# Altium schematic sheet BinaryInput.SchDoc
size A
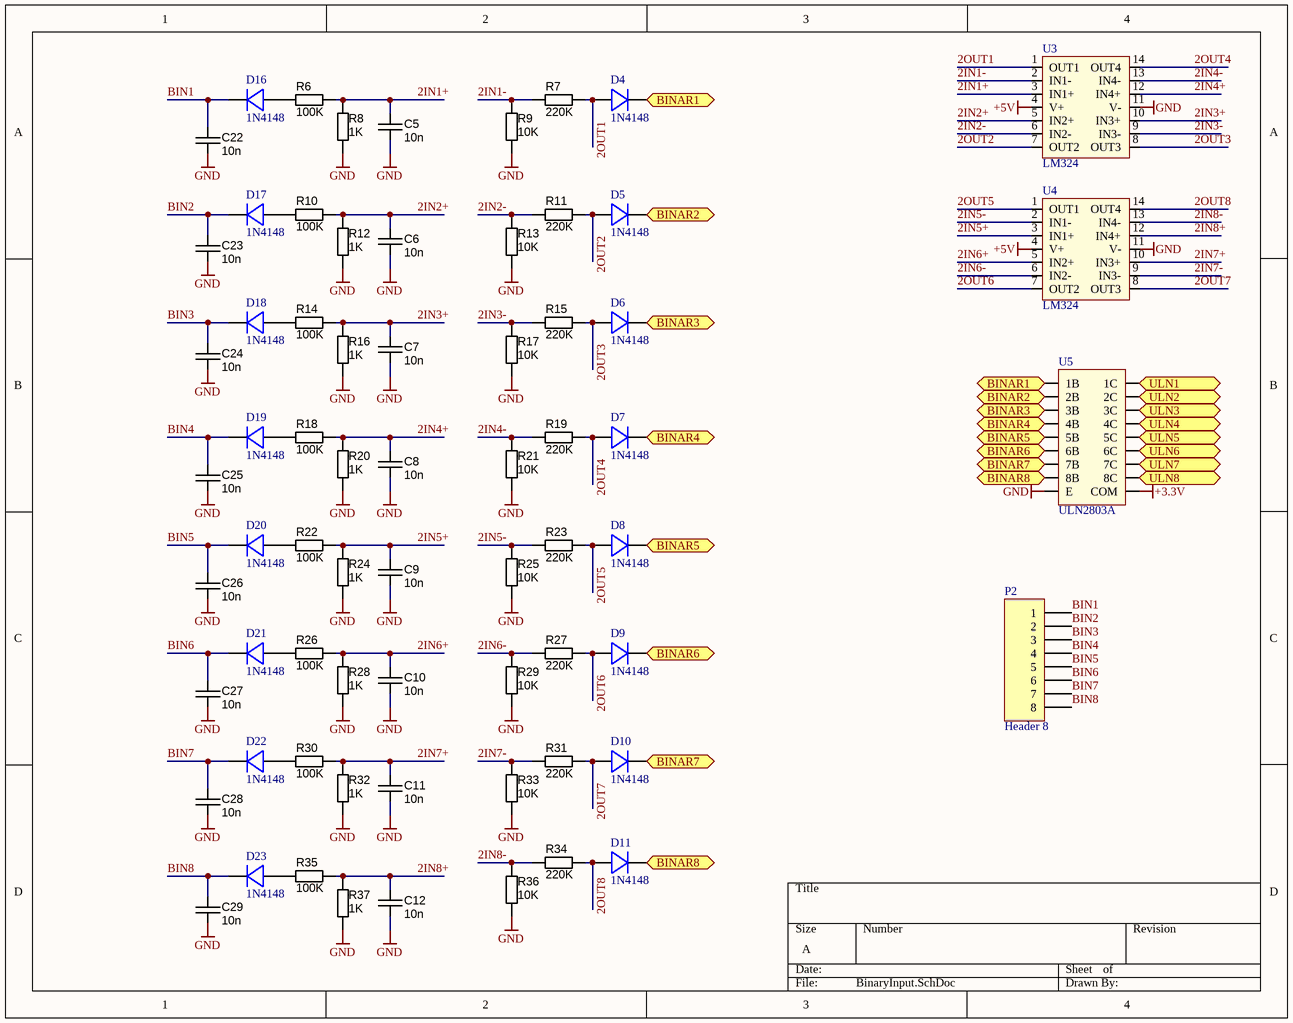
[diagram p0: BinaryInput.SchDoc]

## Parts
C5  value 10n  [CAPC2012X135N]  (hidden comment: approved sub OK)
C6  value 10n  [CAPC2012X135N]  (hidden comment: approved sub OK)
C7  value 10n  [CAPC2012X135N]  (hidden comment: approved sub OK)
C8  value 10n  [CAPC2012X135N]  (hidden comment: approved sub OK)
C9  value 10n  [CAPC2012X135N]  (hidden comment: approved sub OK)
C10  value 10n  [CAPC2012X135N]  (hidden comment: approved sub OK)
C11  value 10n  [CAPC2012X135N]  (hidden comment: approved sub OK)
C12  value 10n  [CAPC2012X135N]  (hidden comment: approved sub OK)
C22  value 10n  [CAPC2012X135N]  (hidden comment: approved sub OK)
C23  value 10n  [CAPC2012X135N]  (hidden comment: approved sub OK)
C24  value 10n  [CAPC2012X135N]  (hidden comment: approved sub OK)
C25  value 10n  [CAPC2012X135N]  (hidden comment: approved sub OK)
C26  value 10n  [CAPC2012X135N]  (hidden comment: approved sub OK)
C27  value 10n  [CAPC2012X135N]  (hidden comment: approved sub OK)
C28  value 10n  [CAPC2012X135N]  (hidden comment: approved sub OK)
C29  value 10n  [CAPC2012X135N]  (hidden comment: approved sub OK)
D4  1N4148  [SOD-323]
D5  1N4148  [SOD-323]
D6  1N4148  [SOD-323]
D7  1N4148  [SOD-323]
D8  1N4148  [SOD-323]
D9  1N4148  [SOD-323]
D10  1N4148  [SOD-323]
D11  1N4148  [SOD-323]
D16  1N4148  [SOD-323]
D17  1N4148  [SOD-323]
D18  1N4148  [SOD-323]
D19  1N4148  [SOD-323]
D20  1N4148  [SOD-323]
D21  1N4148  [SOD-323]
D22  1N4148  [SOD-323]
D23  1N4148  [SOD-323]
P2  Header 8  [HDR1X8]
R6  value 100K  [RESC2012X70N]  (hidden comment: Thick Film)
R7  value 220K  [RESC2012X70N]  (hidden comment: Thick Film)
R8  value 1K  [RESC2012X70N]  (hidden comment: Thick Film)
R9  value 10K  [RESC2012X70N]  (hidden comment: Thick Film)
R10  value 100K  [RESC2012X70N]  (hidden comment: Thick Film)
R11  value 220K  [RESC2012X70N]  (hidden comment: Thick Film)
R12  value 1K  [RESC2012X70N]  (hidden comment: Thick Film)
R13  value 10K  [RESC2012X70N]  (hidden comment: Thick Film)
R14  value 100K  [RESC2012X70N]  (hidden comment: Thick Film)
R15  value 220K  [RESC2012X70N]  (hidden comment: Thick Film)
R16  value 1K  [RESC2012X70N]  (hidden comment: Thick Film)
R17  value 10K  [RESC2012X70N]  (hidden comment: Thick Film)
R18  value 100K  [RESC2012X70N]  (hidden comment: Thick Film)
R19  value 220K  [RESC2012X70N]  (hidden comment: Thick Film)
R20  value 1K  [RESC2012X70N]  (hidden comment: Thick Film)
R21  value 10K  [RESC2012X70N]  (hidden comment: Thick Film)
R22  value 100K  [RESC2012X70N]  (hidden comment: Thick Film)
R23  value 220K  [RESC2012X70N]  (hidden comment: Thick Film)
R24  value 1K  [RESC2012X70N]  (hidden comment: Thick Film)
R25  value 10K  [RESC2012X70N]  (hidden comment: Thick Film)
R26  value 100K  [RESC2012X70N]  (hidden comment: Thick Film)
R27  value 220K  [RESC2012X70N]  (hidden comment: Thick Film)
R28  value 1K  [RESC2012X70N]  (hidden comment: Thick Film)
R29  value 10K  [RESC2012X70N]  (hidden comment: Thick Film)
R30  value 100K  [RESC2012X70N]  (hidden comment: Thick Film)
R31  value 220K  [RESC2012X70N]  (hidden comment: Thick Film)
R32  value 1K  [RESC2012X70N]  (hidden comment: Thick Film)
R33  value 10K  [RESC2012X70N]  (hidden comment: Thick Film)
R34  value 220K  [RESC2012X70N]  (hidden comment: Thick Film)
R35  value 100K  [RESC2012X70N]  (hidden comment: Thick Film)
R36  value 10K  [RESC2012X70N]  (hidden comment: Thick Film)
R37  value 1K  [RESC2012X70N]  (hidden comment: Thick Film)
U3  LM324  [SOIC14]
U4  LM324  [SOIC14]
U5  ULN2803A  [SOP18]

## Ports
BINAR1, BINAR2, BINAR3, BINAR4, BINAR5, BINAR6, BINAR7, BINAR8, ULN1, ULN2, ULN3, ULN4, ULN5, ULN6, ULN7, ULN8

## Nets
+3.3V: U5.10(COM)
+5V: U3.4(V+) U4.4(V+)
GND: C5.2 C6.2 C7.2 C8.2 C9.2 C10.2 C11.2 C12.2 C22.2 C23.2 C24.2 C25.2 C26.2 C27.2 C28.2 C29.2 R8.1 R9.1 R12.1 R13.1 R16.1 R17.1 R20.1 R21.1 R24.1 R25.1 R28.1 R29.1 R32.1 R33.1 R36.1 R37.1 U3.11(V-) U4.11(V-) U5.9(E)
2IN1+: C5.1 R6.2 R8.2 U3.3(IN1+)
2IN1-: R7.1 R9.2 U3.2(IN1-)
2IN2+: C6.1 R10.2 R12.2 U3.5(IN2+)
2IN2-: R11.1 R13.2 U3.6(IN2-)
2IN3+: C7.1 R14.2 R16.2 U3.10(IN3+)
2IN3-: R15.1 R17.2 U3.9(IN3-)
2IN4+: C8.1 R18.2 R20.2 U3.12(IN4+)
2IN4-: R19.1 R21.2 U3.13(IN4-)
2IN5+: C9.1 R22.2 R24.2 U4.3(IN1+)
2IN5-: R23.1 R25.2 U4.2(IN1-)
2IN6+: C10.1 R26.2 R28.2 U4.5(IN2+)
2IN6-: R27.1 R29.2 U4.6(IN2-)
2IN7+: C11.1 R30.2 R32.2 U4.10(IN3+)
2IN7-: R31.1 R33.2 U4.9(IN3-)
2IN8+: C12.1 R35.2 R37.2 U4.12(IN4+)
2IN8-: R34.1 R36.2 U4.13(IN4-)
2OUT1: D4.1(A) R7.2 U3.1(OUT1)
2OUT2: D5.1(A) R11.2 U3.7(OUT2)
2OUT3: D6.1(A) R15.2 U3.8(OUT3)
2OUT4: D7.1(A) R19.2 U3.14(OUT4)
2OUT5: D8.1(A) R23.2 U4.1(OUT1)
2OUT6: D9.1(A) R27.2 U4.7(OUT2)
2OUT7: D10.1(A) R31.2 U4.8(OUT3)
2OUT8: D11.1(A) R34.2 U4.14(OUT4)
BIN1: C22.1 D16.2(K) P2.1
BIN2: C23.1 D17.2(K) P2.2
BIN3: C24.1 D18.2(K) P2.3
BIN4: C25.1 D19.2(K) P2.4
BIN5: C26.1 D20.2(K) P2.5
BIN6: C27.1 D21.2(K) P2.6
BIN7: C28.1 D22.2(K) P2.7
BIN8: C29.1 D23.2(K) P2.8
BINAR1: D4.2(K) U5.1(1B) ; port BINAR1
BINAR2: D5.2(K) U5.2(2B) ; port BINAR2
BINAR3: D6.2(K) U5.3(3B) ; port BINAR3
BINAR4: D7.2(K) U5.4(4B) ; port BINAR4
BINAR5: D8.2(K) U5.5(5B) ; port BINAR5
BINAR6: D9.2(K) U5.6(6B) ; port BINAR6
BINAR7: D10.2(K) U5.7(7B) ; port BINAR7
BINAR8: D11.2(K) U5.8(8B) ; port BINAR8
ULN1: U5.18(1C) ; port ULN1
ULN2: U5.17(2C) ; port ULN2
ULN3: U5.16(3C) ; port ULN3
ULN4: U5.15(4C) ; port ULN4
ULN5: U5.14(5C) ; port ULN5
ULN6: U5.13(6C) ; port ULN6
ULN7: U5.12(7C) ; port ULN7
ULN8: U5.11(8C) ; port ULN8
NetD16_1: D16.1(A) R6.1
NetD17_1: D17.1(A) R10.1
NetD18_1: D18.1(A) R14.1
NetD19_1: D19.1(A) R18.1
NetD20_1: D20.1(A) R22.1
NetD21_1: D21.1(A) R26.1
NetD22_1: D22.1(A) R30.1
NetD23_1: D23.1(A) R35.1

## Library data of the parts
C5-C12 C22-C29 = CAPC_10u_0805_10V: Capacitor SMD Cer 10uF 10% 10V X5R 0805; Manufacturer 1: AVX Corporation; Manufacturer Part Number 1: 0805ZD106KAT2A; Ratings: 10V; X5R; Material: ceramic; SCDType: spec; Package / Case: 0805 (2012 metric); Tolerance: ±10%; Manufacturer 2: Kemet; Manufacturer Part Number 2: C0805C106K8PACTU; Supplier 1: Digi-Key; Supplier Part Number 1: 478-5167-1-ND; ComponentLink1URL: http://www.avx.com/docs/Catalogs/cx5r.pdf; ComponentLink1Description: http://www.avx.com/docs/Catalogs/cx5r.pdf; ComponentLink2URL: http://www.kemet.com/datasheets&C0805C106K8PACTU; ComponentLink2Description: http://www.kemet.com/datasheets&C0805C106K8PACTU; Supplier 2: Digi-Key; Supplier Part Number 2: 399-4925-1-ND
D4-D11 D16-D23 = D 1N4148: Diode SMD SOD-323
P2 = Header 8: Header, 8-Pin; LatestRevisionDate: 17-Jul-2002; LatestRevisionNote: Re-released for DXP Platform.; Publisher: Altium Limited
R6-R37 = RES_10K_0805_1%: Resistor SMD chip 10k Ohm 0.125W 1% 0805; Manufacturer 1: Vishay/Dale; Manufacturer Part Number 1: CRCW080510K0FKEA; Ratings: 1/8W; SCDType: spec; Package / Case: 0805 (2012 metric); Supplier 1: Digi-Key; Supplier Part Number 1: 541-10.0KCCT-ND; Material: Thick Film; Tolerance: ±1%
U5 = ULN2803A: Darlington Transistor Arrays; Mouser: 595-ULN2803ADWR